# Altium schematic sheet MM32P48.SchDoc
size A4
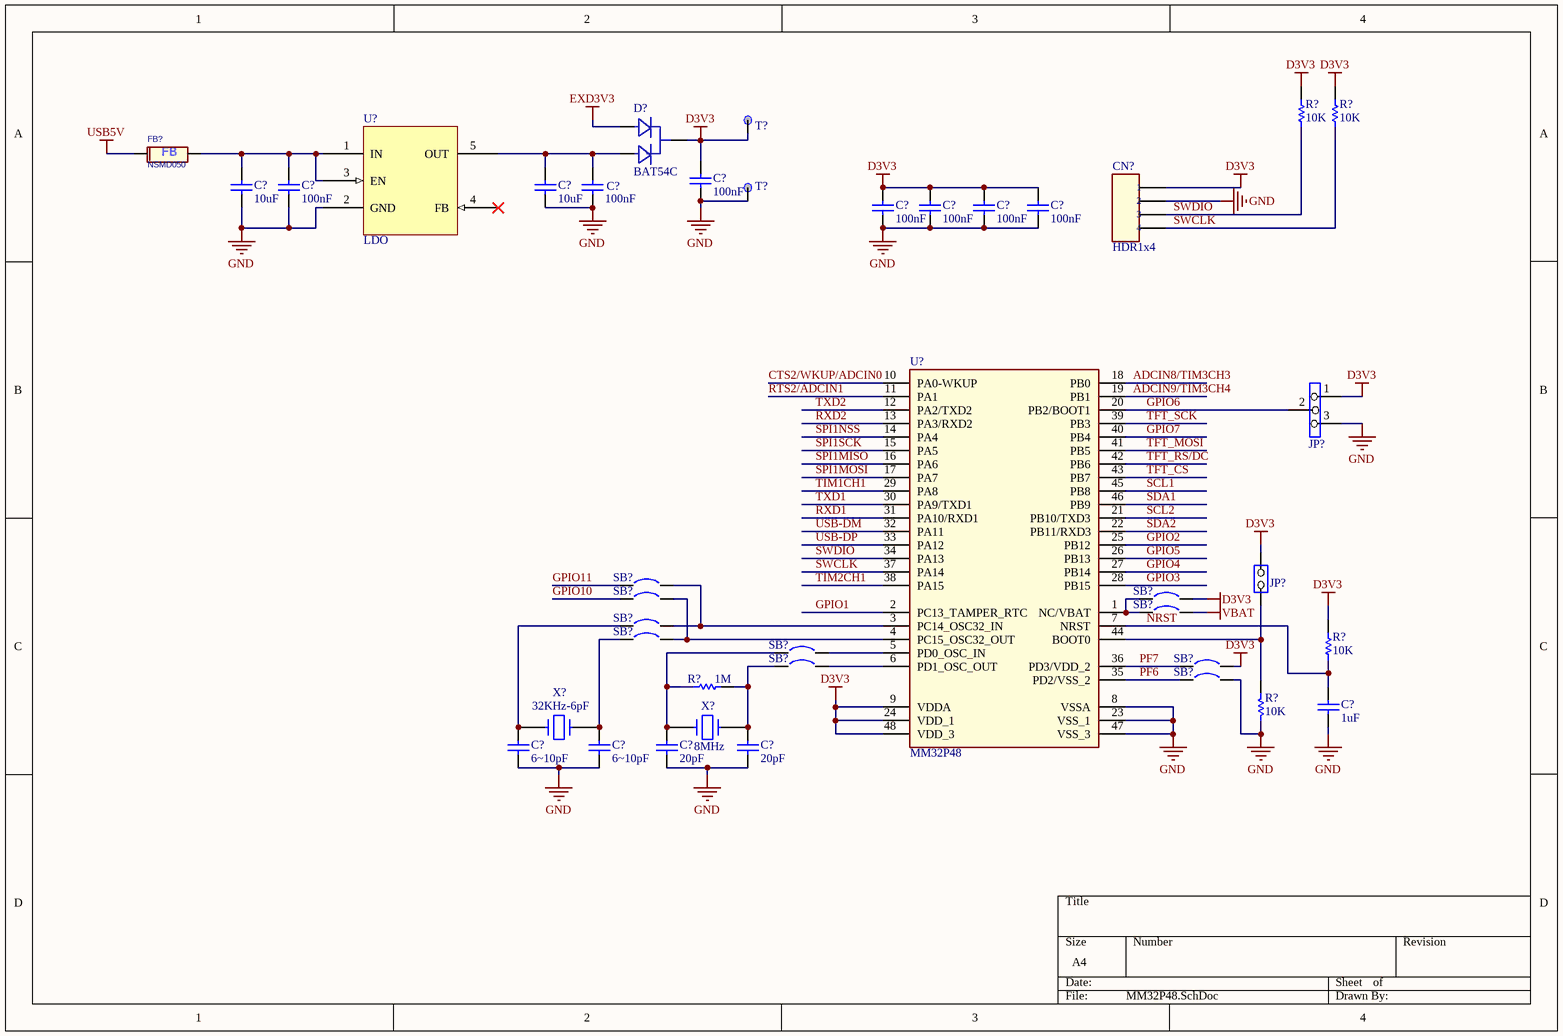
[diagram p0: MM32P48.SchDoc]

## Parts
(Parts that share a designator on the sheet are numbered #1, #2 ... from top to bottom, then left to right.)
C?#1  100nF  [C0603L]
C?#2  10uF  [C0805]
C?#3  100nF  [C0603L]
C?#4  10uF  [C0805]
C?#5  100nF  [C0603L]
C?#6  100nF  [C0603L]
C?#7  100nF  [C0603L]
C?#8  100nF  [C0603L]
C?#9  100nF  [C0603L]
C?#10  1uF  [C0603L]
C?#11  6~10pF  [C0603L]
C?#12  6~10pF  [C0603L]
C?#13  20pF  [C0603L]
C?#14  20pF  [C0603L]
CN?  HDR1x4  [HDR1x4]
D?  BAT54C  [BAT54C]
FB?  NSMD050  [R1206]
JP?#1  Jumper3  [HDR1X3/2.00mm]  (value not drawn)
JP?#2  Jumper2-2  [HDR1X2/2.00MM]  (value not drawn)
R?#1  10K  [R0603]
R?#2  10K  [R0603]
R?#3  10K  [R0603]
R?#4  1M  [R0603]
R?#5  10K  [R0603]
SB?#1  Circuit Breaker  [JP2_SMD]  (value not drawn)
SB?#2  Circuit Breaker  [JP2_SMD]  (value not drawn)
SB?#3  Circuit Breaker  [JP2_SMD]  (value not drawn)
SB?#4  Circuit Breaker  [JP2_SMD]  (value not drawn)
SB?#5  Circuit Breaker  [JP2_SMD]  (value not drawn)
SB?#6  Circuit Breaker  [JP2_SMD]  (value not drawn)
SB?#7  Circuit Breaker  [JP2_SMD]  (value not drawn)
SB?#8  Circuit Breaker  [JP2_SMD]  (value not drawn)
SB?#9  Circuit Breaker  [JP2_SMD]  (value not drawn)
SB?#10  Circuit Breaker  [JP2_SMD]  (value not drawn)
T?#1  TP  [TP]  (value not drawn)
T?#2  TP  [TP]  (value not drawn)
U?#1  LDO  [SOT23-5]
U?#2  MM32P48  [LQFP-48]
X?#1  32KHz-6pF  [XTAL0602]
X?#2  8MHz  [XTAL_socket]

## Nets
D3V3: C?#1.1 C?#6.1 C?#7.1 C?#8.1 C?#9.1 CN?.1 D?.3 JP?#1.1 JP?#2.2(NO) R?#1.2 R?#2.2 R?#3.2 SB?#3.2 SB?#9.2 T?#1.1 U?#2.9(VDDA) U?#2.24(VDD_1) U?#2.48(VDD_3)
EXD3V3: D?.2
GND: C?#1.2 C?#2.2 C?#3.2 C?#4.2 C?#5.2 C?#6.2 C?#7.2 C?#8.2 C?#9.2 C?#10.2 C?#11.2 C?#12.2 C?#13.2 C?#14.2 CN?.2 JP?#1.3 R?#5.1 SB?#10.2 T?#2.1 U?#1.2(GND) U?#2.8(VSSA) U?#2.23(VSS_1) U?#2.47(VSS_3)
USB5V: FB?.1
VBAT: SB?#4.2
ADCIN8/TIM3CH3: U?#2.18(PB0)
ADCIN9/TIM3CH4: U?#2.19(PB1)
CTS2/WKUP/ADCIN0: U?#2.10(PA0-WKUP)
GPIO1: U?#2.2(PC13_TAMPER_RTC)
GPIO2: U?#2.25(PB12)
GPIO3: U?#2.28(PB15)
GPIO4: U?#2.27(PB14)
GPIO5: U?#2.26(PB13)
GPIO6: JP?#1.2 U?#2.20(PB2/BOOT1)
GPIO7: U?#2.40(PB4)
GPIO10: SB?#2.1
GPIO11: SB?#1.1
NRST: C?#10.1 R?#3.1 U?#2.7(NRST)
PF6: SB?#10.1 U?#2.35(PD2/VSS_2)
PF7: SB?#9.1 U?#2.36(PD3/VDD_2)
RTS2/ADCIN1: U?#2.11(PA1)
RXD1: U?#2.31(PA10/RXD1)
RXD2: U?#2.13(PA3/RXD2)
SCL1: U?#2.45(PB8)
SCL2: U?#2.21(PB10/TXD3)
SDA1: U?#2.46(PB9)
SDA2: U?#2.22(PB11/RXD3)
SPI1MISO: U?#2.16(PA6)
SPI1MOSI: U?#2.17(PA7)
SPI1NSS: U?#2.14(PA4)
SPI1SCK: U?#2.15(PA5)
SWCLK: CN?.4 R?#2.1 U?#2.37(PA14)
SWDIO: CN?.3 R?#1.1 U?#2.34(PA13)
TFT_CS: U?#2.43(PB7)
TFT_MOSI: U?#2.41(PB5)
TFT_RS/DC: U?#2.42(PB6)
TFT_SCK: U?#2.39(PB3)
TIM1CH1: U?#2.29(PA8)
TIM2CH1: U?#2.38(PA15)
TXD1: U?#2.30(PA9/TXD1)
TXD2: U?#2.12(PA2/TXD2)
USB-DM: U?#2.32(PA11)
USB-DP: U?#2.33(PA12)
NetC?#2_1: C?#2.1 C?#3.1 FB?.2 U?#1.1(IN) U?#1.3(EN)
NetC?#4_1: C?#4.1 C?#5.1 D?.1 U?#1.5(OUT)
NetC?#11_1: C?#11.1 SB?#5.1 X?#1.2
NetC?#12_1: C?#12.1 SB?#6.1 X?#1.1
NetC?#13_1: C?#13.1 R?#4.1 SB?#7.1 X?#2.2
NetC?#14_1: C?#14.1 R?#4.2 SB?#8.1 X?#2.1
NetJP?#2_1: JP?#2.1(COMMON) R?#5.2 U?#2.44(BOOT0)
NetSB?#1_2: SB?#1.2 SB?#5.2 U?#2.3(PC14_OSC32_IN)
NetSB?#2_2: SB?#2.2 SB?#6.2 U?#2.4(PC15_OSC32_OUT)
NetSB?#3_1: SB?#3.1 SB?#4.1 U?#2.1(NC/VBAT)
NetSB?#7_2: SB?#7.2 U?#2.5(PD0_OSC_IN)
NetSB?#8_2: SB?#8.2 U?#2.6(PD1_OSC_OUT)

Not connected (* = marked no-connect by the designer): U?#1 4(FB)*

## Library data of the parts
C?#1-C?#14 = Cap: Capacitor; Published: 8-Jun-2000; LatestRevisionDate: 17-Jul-2002; LatestRevisionNote: Re-released for DXP Platform.; PackageReference: RAD-0.3; Publisher: Altium Limited
  C?#1 C?#3 C?#5-C?#9: Value: 100nF
  C?#2 C?#4: Value: 10uF
  C?#10: Value: 1uF
  C?#11 C?#12: Value: 6~10pF
  C?#13 C?#14: Value: 20pF
CN? = CON4
D? = BAT54C: DOUBLE SHOTTKEY DIODES
FB? = FB: Ferrite Beads Inductors Impedance:120Ω±25% Rated Current:1500mA DC Resistance:0.095Ω; Manufacturer: muRata; Manufacturer Part Number: BLM15EG121SN1
JP?#2 = Jumper2-2: Jumper2
R?#1-R?#5 = RES: Resistor; Design Item Id: RES-50R-1%-0805
SB?#1-SB?#10 = Circuit Breaker: Solder: YES; Published: 24-Mar-1999; Revision: July-2002: Re-released for DXP Platform.; Publisher: Altium Limited
T?#1 T?#2 = TP: Test Point
U?#1 = LDO-SOT23-5: General LDO SOT23-5
U?#2 = MM32P48: Cortex M3, 48-pin LQFP
X?#1 X?#2 = CRYSTAL